# Altium schematic sheet Logic.SchDoc
size C; SheetNumber: 1; SheetTotal: 1
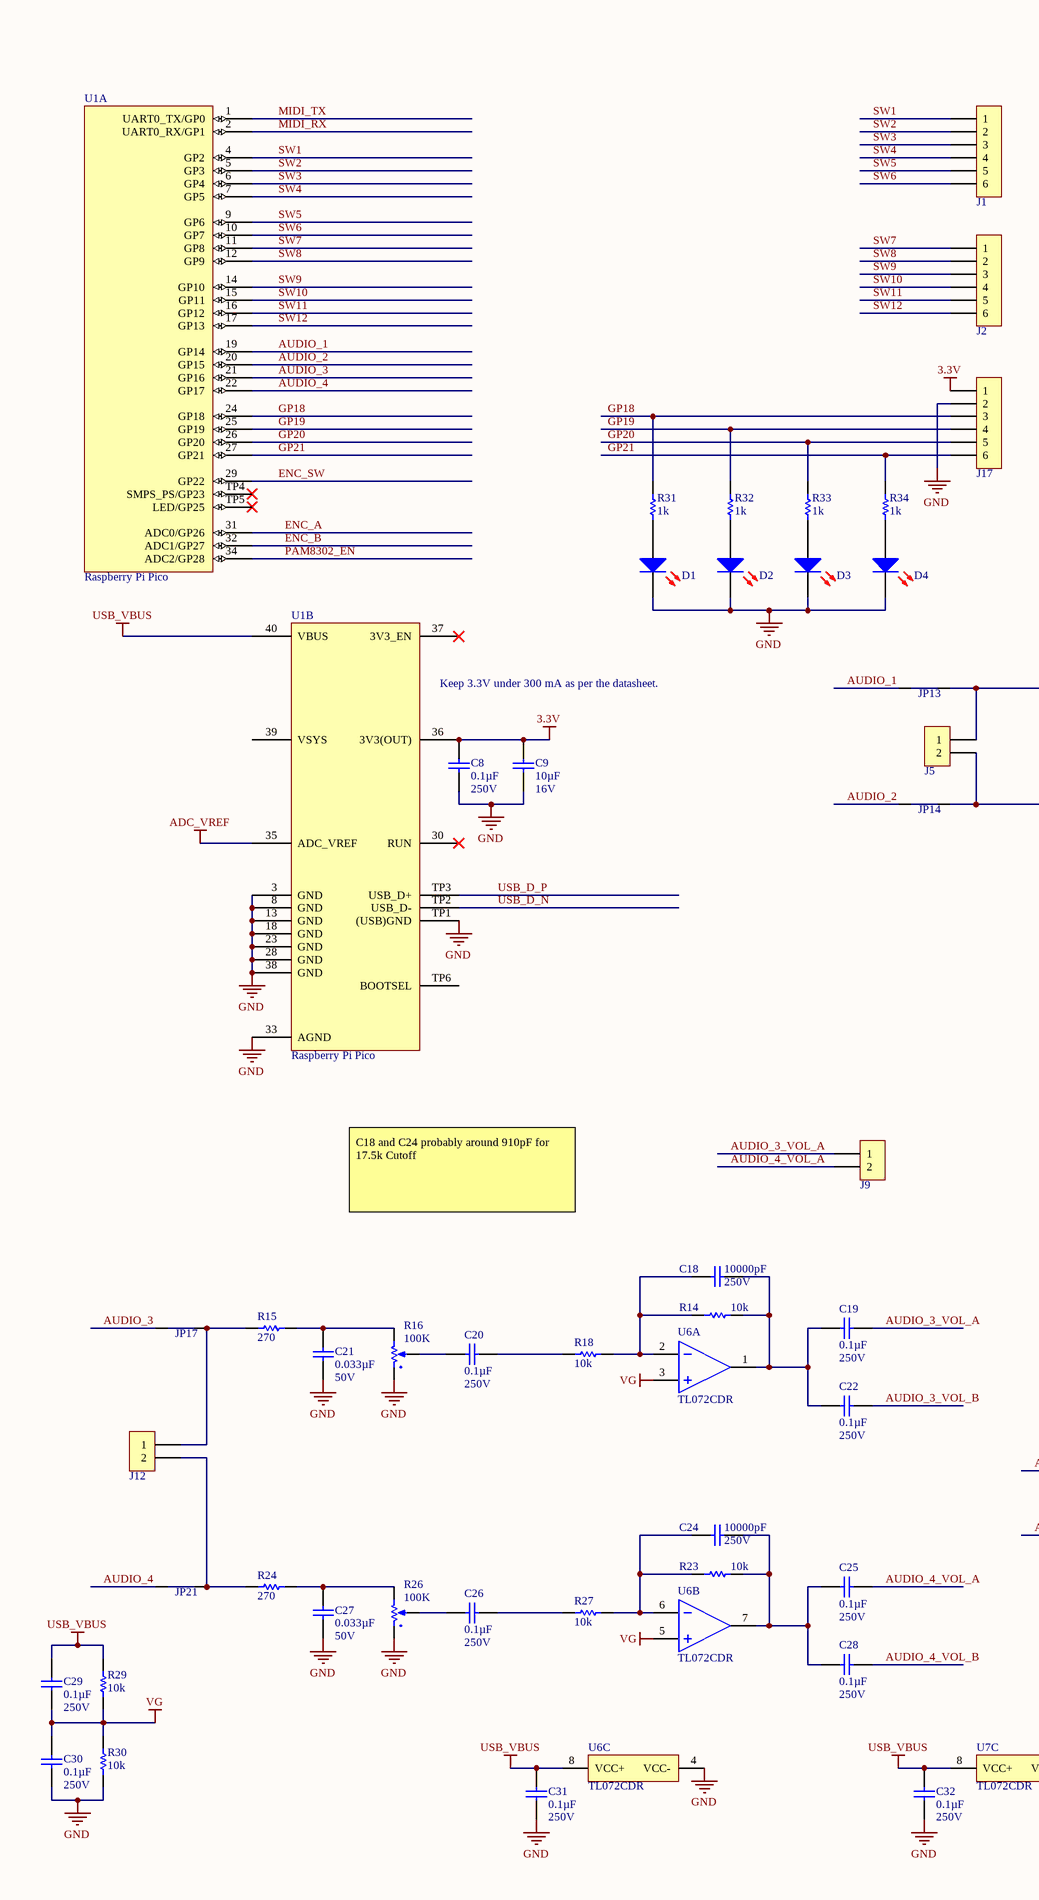
[diagram p0: Logic.SchDoc, left]
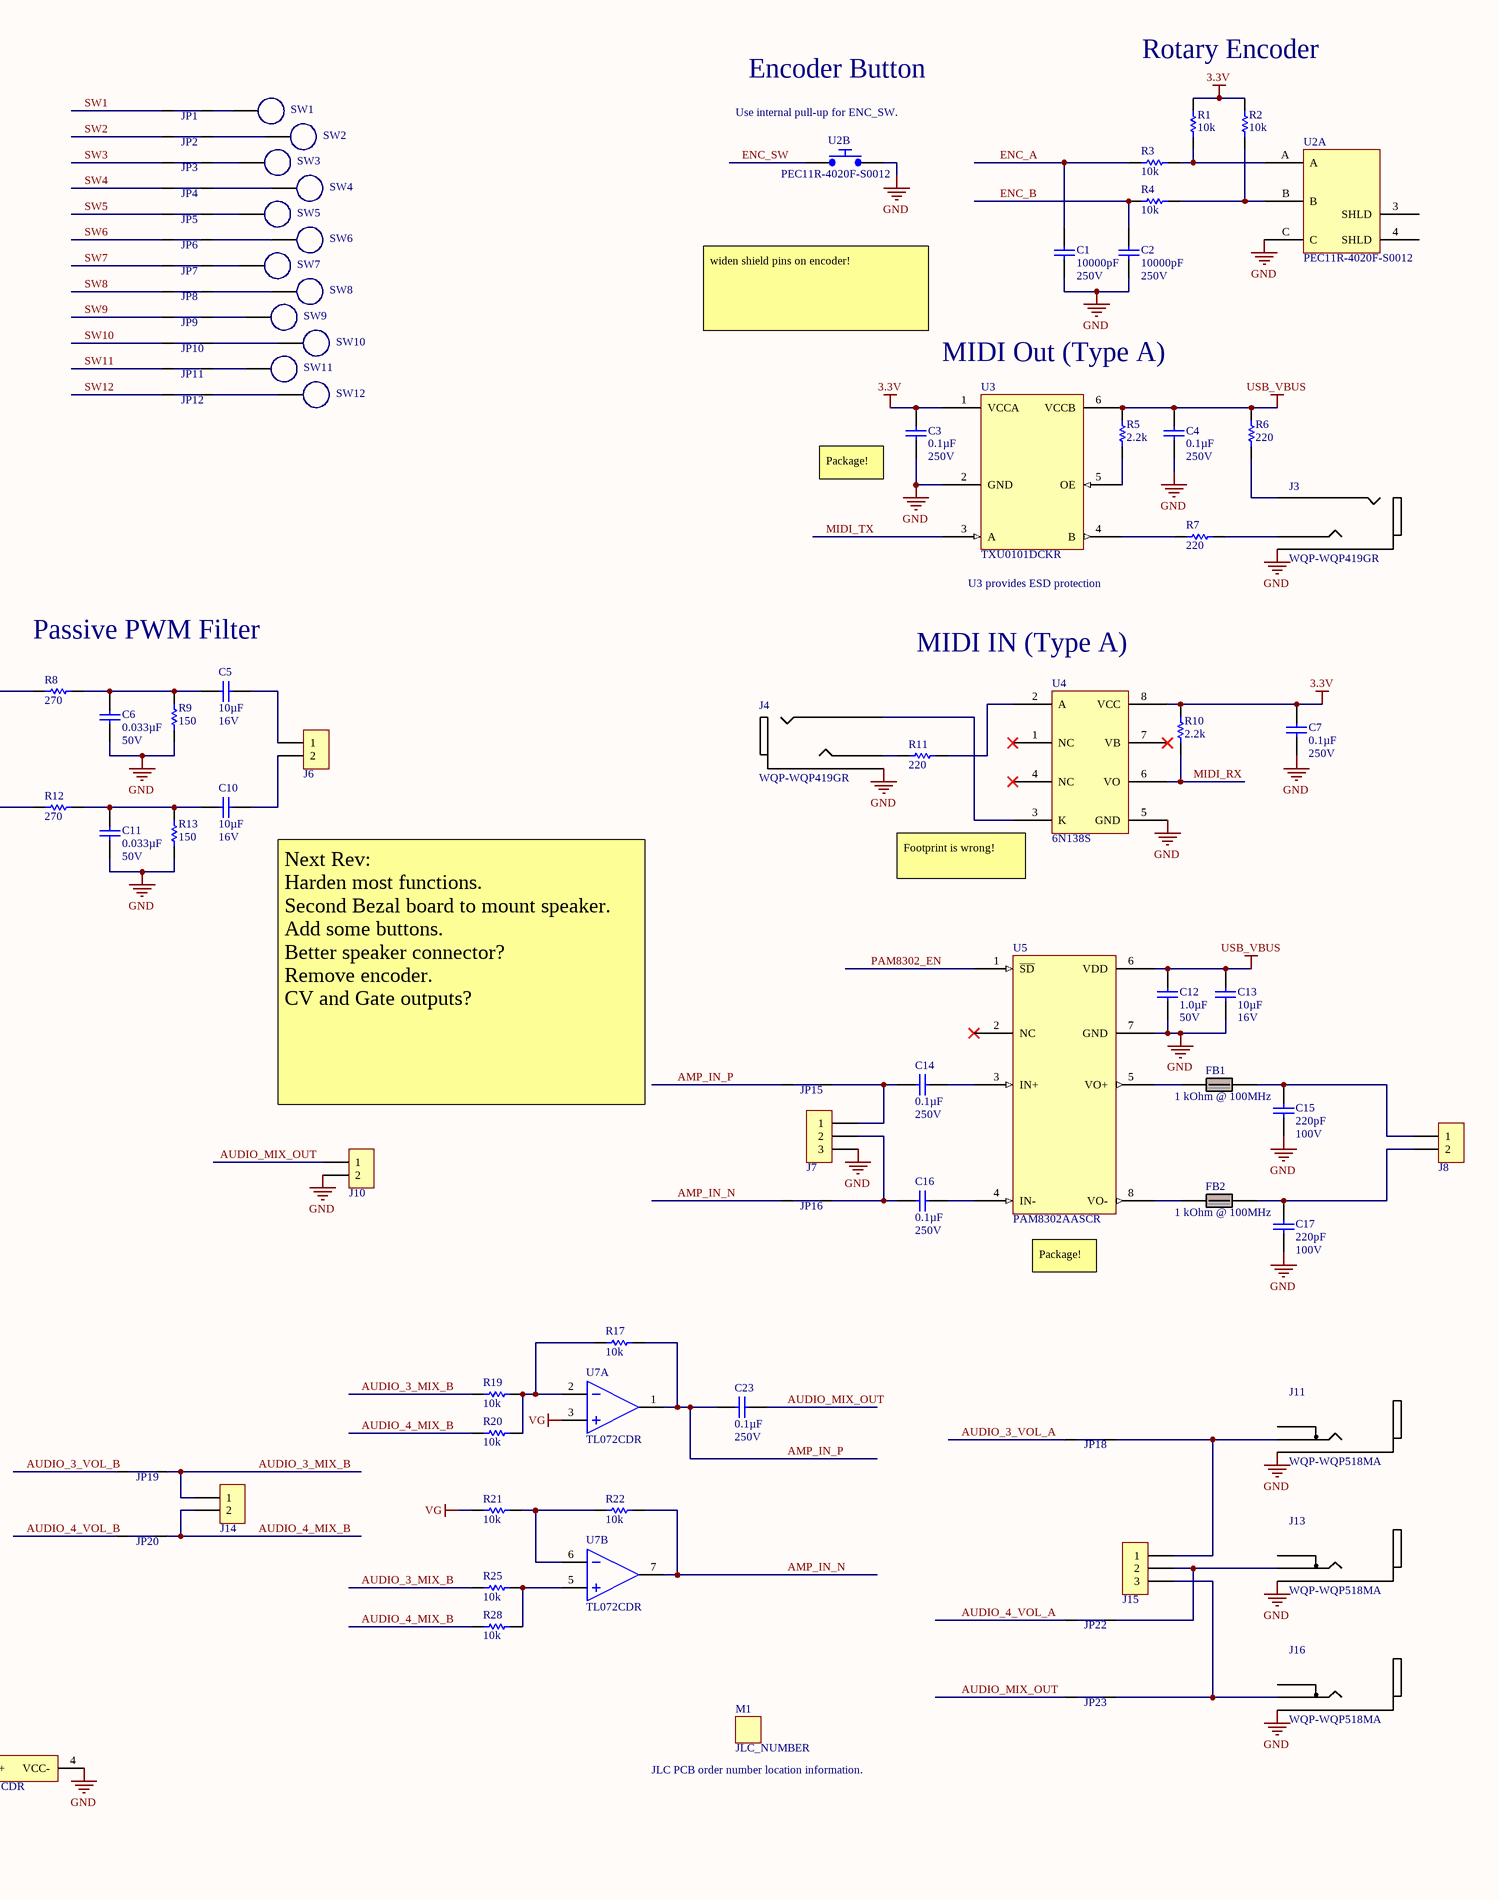
[diagram p1: Logic.SchDoc, right]

## Parts
C1  10000pF  Voltage: 250V  [Chip0805]
C2  10000pF  Voltage: 250V  [Chip0805]
C3  0.1µF  Voltage: 250V  [Chip0805]
C4  0.1µF  Voltage: 250V  [Chip0805]
C5  10µF  Voltage: 16V  [Chip0805]
C6  0.033µF  Voltage: 50V  [Chip0805]
C7  0.1µF  Voltage: 250V  [Chip0805]
C8  0.1µF  Voltage: 250V  [Chip0805]
C9  10µF  Voltage: 16V  [Chip0805]
C10  10µF  Voltage: 16V  [Chip0805]
C11  0.033µF  Voltage: 50V  [Chip0805]
C12  1.0µF  Voltage: 50V  [Chip0805]
C13  10µF  Voltage: 16V  [Chip0805]
C14  0.1µF  Voltage: 250V  [Chip0805]
C15  220pF  Voltage: 100V  [Chip0805]
C16  0.1µF  Voltage: 250V  [Chip0805]
C17  220pF  Voltage: 100V  [Chip0805]
C18  10000pF  Voltage: 250V  [Chip0805]
C19  0.1µF  Voltage: 250V  [Chip0805]
C20  0.1µF  Voltage: 250V  [Chip0805]
C21  0.033µF  Voltage: 50V  [Chip0805]
C22  0.1µF  Voltage: 250V  [Chip0805]
C23  0.1µF  Voltage: 250V  [Chip0805]
C24  10000pF  Voltage: 250V  [Chip0805]
C25  0.1µF  Voltage: 250V  [Chip0805]
C26  0.1µF  Voltage: 250V  [Chip0805]
C27  0.033µF  Voltage: 50V  [Chip0805]
C28  0.1µF  Voltage: 250V  [Chip0805]
C29  0.1µF  Voltage: 250V  [Chip0805]
C30  0.1µF  Voltage: 250V  [Chip0805]
C31  0.1µF  Voltage: 250V  [Chip0805]
C32  0.1µF  Voltage: 250V  [Chip0805]
D1  RED  [LED0603]  (value not drawn)
D2  RED  [LED0603]  (value not drawn)
D3  RED  [LED0603]  (value not drawn)
D4  RED  [LED0603]  (value not drawn)
FB1  Impedance @ Frequency: 1 kOhm @ 100MHz  [Chip0805]  (hidden comment: FERRITE)
FB2  Impedance @ Frequency: 1 kOhm @ 100MHz  [Chip0805]  (hidden comment: FERRITE)
J1  HEADER_1x6_NO_BOM  [HEADER_1x6_100mil_NP]  (value not drawn)  (no BOM)
J2  HEADER_1x6_NO_BOM  [HEADER_1x6_100mil_NP]  (value not drawn)  (no BOM)
J3  WQP-WQP419GR  [PJ366ST]
J4  WQP-WQP419GR  [PJ366ST]
J5  HEADER_1x2_NO_BOM  [HEADER_1x2_100mil_NP]  (value not drawn)  (no BOM)
J6  HEADER_1x2_NO_BOM  [HEADER_1x2_100mil_NP]  (value not drawn)  (no BOM)
J7  HEADER_1x3_NO_BOM  [HEADER_1x3_100mil_NP]  (value not drawn)  (no BOM)
J8  HEADER_1x2_NO_BOM  [HEADER_1x2_100mil_NP]  (value not drawn)  (no BOM)
J9  HEADER_1x2_NO_BOM  [HEADER_1x2_100mil_NP]  (value not drawn)  (no BOM)
J10  HEADER_1x2_NO_BOM  [HEADER_1x2_100mil_NP]  (value not drawn)  (no BOM)
J11  WQP-WQP518MA  [PJ301M-12]
J12  HEADER_1x2_NO_BOM  [HEADER_1x2_100mil_NP]  (value not drawn)  (no BOM)
J13  WQP-WQP518MA  [PJ301M-12]
J14  HEADER_1x2_NO_BOM  [HEADER_1x2_100mil_NP]  (value not drawn)  (no BOM)
J15  HEADER_1x3_NO_BOM  [HEADER_1x3_100mil_NP]  (value not drawn)  (no BOM)
J16  WQP-WQP518MA  [PJ301M-12]
J17  HEADER_1x6_NO_BOM  [HEADER_1x6_100mil_NP]  (value not drawn)  (no BOM)
JP1  JUMMPER_NC_0805  [JUMMPER_NC_0805]  (value not drawn)  (net tie, no BOM)
JP2  JUMMPER_NC_0805  [JUMMPER_NC_0805]  (value not drawn)  (net tie, no BOM)
JP3  JUMMPER_NC_0805  [JUMMPER_NC_0805]  (value not drawn)  (net tie, no BOM)
JP4  JUMMPER_NC_0805  [JUMMPER_NC_0805]  (value not drawn)  (net tie, no BOM)
JP5  JUMMPER_NC_0805  [JUMMPER_NC_0805]  (value not drawn)  (net tie, no BOM)
JP6  JUMMPER_NC_0805  [JUMMPER_NC_0805]  (value not drawn)  (net tie, no BOM)
JP7  JUMMPER_NC_0805  [JUMMPER_NC_0805]  (value not drawn)  (net tie, no BOM)
JP8  JUMMPER_NC_0805  [JUMMPER_NC_0805]  (value not drawn)  (net tie, no BOM)
JP9  JUMMPER_NC_0805  [JUMMPER_NC_0805]  (value not drawn)  (net tie, no BOM)
JP10  JUMMPER_NC_0805  [JUMMPER_NC_0805]  (value not drawn)  (net tie, no BOM)
JP11  JUMMPER_NC_0805  [JUMMPER_NC_0805]  (value not drawn)  (net tie, no BOM)
JP12  JUMMPER_NC_0805  [JUMMPER_NC_0805]  (value not drawn)  (net tie, no BOM)
JP13  JUMMPER_NC_0805  [JUMMPER_NC_0805]  (value not drawn)  (net tie, no BOM)
JP14  JUMMPER_NC_0805  [JUMMPER_NC_0805]  (value not drawn)  (net tie, no BOM)
JP15  JUMMPER_NC_0805  [JUMMPER_NC_0805]  (value not drawn)  (net tie, no BOM)
JP16  JUMMPER_NC_0805  [JUMMPER_NC_0805]  (value not drawn)  (net tie, no BOM)
JP17  JUMMPER_NC_0805  [JUMMPER_NC_0805]  (value not drawn)  (net tie, no BOM)
JP18  JUMMPER_NC_0805  [JUMMPER_NC_0805]  (value not drawn)  (net tie, no BOM)
JP19  JUMMPER_NC_0805  [JUMMPER_NC_0805]  (value not drawn)  (net tie, no BOM)
JP20  JUMMPER_NC_0805  [JUMMPER_NC_0805]  (value not drawn)  (net tie, no BOM)
JP21  JUMMPER_NC_0805  [JUMMPER_NC_0805]  (value not drawn)  (net tie, no BOM)
JP22  JUMMPER_NC_0805  [JUMMPER_NC_0805]  (value not drawn)  (net tie, no BOM)
JP23  JUMMPER_NC_0805  [JUMMPER_NC_0805]  (value not drawn)  (net tie, no BOM)
M1  JLC_NUMBER  [JLC_NUMBER]  (no BOM)
R1  10k  [Chip0805]
R2  10k  [Chip0805]
R3  10k  [Chip0805]
R4  10k  [Chip0805]
R5  2.2k  [Chip0805]
R6  220  [Chip0805]
R7  220  [Chip0805]
R8  270  [Chip0805]
R9  150  [Chip0805]
R10  2.2k  [Chip0805]
R11  220  [Chip0805]
R12  270  [Chip0805]
R13  150  [Chip0805]
R14  10k  [Chip0805]
R15  270  [Chip0805]
R16  100K  [Alpha_RD901F-40-15R]
R17  10k  [Chip0805]
R18  10k  [Chip0805]
R19  10k  [Chip0805]
R20  10k  [Chip0805]
R21  10k  [Chip0805]
R22  10k  [Chip0805]
R23  10k  [Chip0805]
R24  270  [Chip0805]
R25  10k  [Chip0805]
R26  100K  [Alpha_RD901F-40-15R]
R27  10k  [Chip0805]
R28  10k  [Chip0805]
R29  10k  [Chip0805]
R30  10k  [Chip0805]
R31  1k  [Chip0805]
R32  1k  [Chip0805]
R33  1k  [Chip0805]
R34  1k  [Chip0805]
SW1  TOUCH_PAD_NO_BOM  [TENTED_PAD_5mil]  (value not drawn)  (no BOM)
SW2  TOUCH_PAD_NO_BOM  [TENTED_PAD_5mil]  (value not drawn)  (no BOM)
SW3  TOUCH_PAD_NO_BOM  [TENTED_PAD_5mil]  (value not drawn)  (no BOM)
SW4  TOUCH_PAD_NO_BOM  [TENTED_PAD_5mil]  (value not drawn)  (no BOM)
SW5  TOUCH_PAD_NO_BOM  [TENTED_PAD_5mil]  (value not drawn)  (no BOM)
SW6  TOUCH_PAD_NO_BOM  [TENTED_PAD_5mil]  (value not drawn)  (no BOM)
SW7  TOUCH_PAD_NO_BOM  [TENTED_PAD_5mil]  (value not drawn)  (no BOM)
SW8  TOUCH_PAD_NO_BOM  [TENTED_PAD_5mil]  (value not drawn)  (no BOM)
SW9  TOUCH_PAD_NO_BOM  [TENTED_PAD_5mil]  (value not drawn)  (no BOM)
SW10  TOUCH_PAD_NO_BOM  [TENTED_PAD_5mil]  (value not drawn)  (no BOM)
SW11  TOUCH_PAD_NO_BOM  [TENTED_PAD_5mil]  (value not drawn)  (no BOM)
SW12  TOUCH_PAD_NO_BOM  [TENTED_PAD_5mil]  (value not drawn)  (no BOM)
U1  Raspberry Pi Pico  [RASPBERRY_PI_PICO]  (parts A,B of 2)
U2  PEC11R-4020F-S0012  [BOURNS_PEC11R-4020F-S]  (parts A,B of 2)
U3  TXU0101DCKR  [6-TSSOP]
U4  6N138S  [6N13XS]
U5  PAM8302AASCR  [8-MSOP]
U6  TL072CDR  [8-SOIC]  (parts A,B,C of 3)
U7  TL072CDR  [8-SOIC]  (parts A,B,C of 3)

## Nets
3.3V: C3.2 C7.2 C8.2 C9.2 J17.1 R1.2 R2.2 R10.2 U1.36(3V3(OUT)) U3.1(VCCA) U4.8(VCC)
ADC_VREF: U1.35(ADC_VREF)
GND: C1.1 C2.1 C3.1 C4.1 C6.1 C7.1 C8.1 C9.1 C11.1 C12.1 C13.1 C15.1 C17.1 C21.1 C27.1 C30.2 C31.2 C32.2 D1.2(C) D2.2(C) D3.2(C) D4.2(C) J3.1 J4.1 J7.3 J10.2 J11.1 J13.1 J16.1 J17.2 R9.1 R13.1 R16.1(BOT) R26.1(BOT) R30.2 U1.3(GND) U1.8(GND) U1.13(GND) U1.18(GND) U1.23(GND) U1.28(GND) U1.33(AGND) U1.38(GND) U1.TP1((USB)GND) U2.1 U2.C U3.2(GND) U4.5(GND) U5.7(GND) U6.4(VCC-) U7.4(VCC-)
USB_VBUS: C4.2 C12.2 C13.2 C29.1 C31.1 C32.1 R5.2 R6.2 R29.1 U1.40(VBUS) U3.6(VCCB) U5.6(VDD) U6.8(VCC+) U7.8(VCC+)
VG: C29.2 C30.1 R21.2 R29.2 R30.1 U6.3(IN1+) U6.5(IN2+) U7.3(IN1+)
AMP_IN_N: JP16.1 R22.1 U7.7(OUT2)
AMP_IN_P: C23.2 JP15.1 R17.1 U7.1(OUT1)
AUDIO_1: JP13.1 U1.19(GP14)
AUDIO_2: JP14.1 U1.20(GP15)
AUDIO_3: JP17.1 U1.21(GP16)
AUDIO_3_MIX_B: J14.1 JP19.2 R19.2 R25.2
AUDIO_3_VOL_A: C19.1 J9.1 JP18.1
AUDIO_3_VOL_B: C22.1 JP19.1
AUDIO_4: JP21.1 U1.22(GP17)
AUDIO_4_MIX_B: J14.2 JP20.2 R20.2 R28.2
AUDIO_4_VOL_A: C25.1 J9.2 JP22.1
AUDIO_4_VOL_B: C28.1 JP20.1
AUDIO_MIX_OUT: C23.1 J10.1 JP23.1
ENC_A: C1.2 R3.2 U1.31(ADC0/GP26)
ENC_B: C2.2 R4.2 U1.32(ADC1/GP27)
ENC_SW: U1.29(GP22) U2.2
GP18: J17.3 R31.2 U1.24(GP18)
GP19: J17.4 R32.2 U1.25(GP19)
GP20: J17.5 R33.2 U1.26(GP20)
GP21: J17.6 R34.2 U1.27(GP21)
MIDI_RX: R10.1 U1.2(UART0_RX/GP1) U4.6(VO)
MIDI_TX: U1.1(UART0_TX/GP0) U3.3(A)
PAM8302_EN: U1.34(ADC2/GP28) U5.1(~{SD})
SW1: J1.1 JP1.1 U1.4(GP2)
SW2: J1.2 JP2.1 U1.5(GP3)
SW3: J1.3 JP3.1 U1.6(GP4)
SW4: J1.4 JP4.1 U1.7(GP5)
SW5: J1.5 JP5.1 U1.9(GP6)
SW6: J1.6 JP6.1 U1.10(GP7)
SW7: J2.1 JP7.1 U1.11(GP8)
SW8: J2.2 JP8.1 U1.12(GP9)
SW9: J2.3 JP9.1 U1.14(GP10)
SW10: J2.4 JP10.1 U1.15(GP11)
SW11: J2.5 JP11.1 U1.16(GP12)
SW12: J2.6 JP12.1 U1.17(GP13)
USB_D_N: U1.TP2(USB_D-)
USB_D_P: U1.TP3(USB_D+)
NetC5_1: C5.1 C6.2 R8.2 R9.2
NetC5_2: C5.2 J6.1
NetC10_1: C10.1 C11.2 R12.2 R13.2
NetC10_2: C10.2 J6.2
NetC14_1: C14.1 U5.3(IN+)
NetC14_2: C14.2 J7.1 JP15.2
NetC15_2: C15.2 FB1.2 J8.1
NetC16_1: C16.1 U5.4(IN-)
NetC16_2: C16.2 J7.2 JP16.2
NetC17_2: C17.2 FB2.2 J8.2
NetC18_1: C18.1 C19.2 C22.2 R14.1 U6.1(OUT1)
NetC18_2: C18.2 R14.2 R18.1 U6.2(IN1-)
NetC20_1: C20.1 R18.2
NetC20_2: C20.2 R16.2(TAP)
NetC21_2: C21.2 R15.2 R16.3(TOP)
NetC24_1: C24.1 C25.2 C28.2 R23.1 U6.7(OUT2)
NetC24_2: C24.2 R23.2 R27.1 U6.6(IN2-)
NetC26_1: C26.1 R27.2
NetC26_2: C26.2 R26.2(TAP)
NetC27_2: C27.2 R24.2 R26.3(TOP)
NetD1_1: D1.1(A) R31.1
NetD2_1: D2.1(A) R32.1
NetD3_1: D3.1(A) R33.1
NetD4_1: D4.1(A) R34.1
NetFB1_1: FB1.1 U5.5(VO+)
NetFB2_1: FB2.1 U5.8(VO-)
NetJ3_2: J3.2 R6.1
NetJ3_3: J3.3 R7.2
NetJ4_2: J4.2 U4.3(K)
NetJ4_3: J4.3 R11.1
NetJ5_1: J5.1 JP13.2 R8.1
NetJ5_2: J5.2 JP14.2 R12.1
NetJ11_3: J11.3 J15.1 JP18.2
NetJ12_1: J12.1 JP17.2 R15.1
NetJ12_2: J12.2 JP21.2 R24.1
NetJ13_3: J13.3 J15.2 JP22.2
NetJ15_3: J15.3 J16.3 JP23.2
NetJP1_2: JP1.2 SW1.1
NetJP2_2: JP2.2 SW2.1
NetJP3_2: JP3.2 SW3.1
NetJP4_2: JP4.2 SW4.1
NetJP5_2: JP5.2 SW5.1
NetJP6_2: JP6.2 SW6.1
NetJP7_2: JP7.2 SW7.1
NetJP8_2: JP8.2 SW8.1
NetJP9_2: JP9.2 SW9.1
NetJP10_2: JP10.2 SW10.1
NetJP11_2: JP11.2 SW11.1
NetJP12_2: JP12.2 SW12.1
NetR1_1: R1.1 R3.1 U2.A
NetR2_1: R2.1 R4.1 U2.B
NetR5_1: R5.1 U3.5(OE)
NetR7_1: R7.1 U3.4(B)
NetR11_2: R11.2 U4.2(A)
NetR17_2: R17.2 R19.1 R20.1 U7.2(IN1-)
NetR21_1: R21.1 R22.2 U7.6(IN2-)
NetR25_1: R25.1 R28.1 U7.5(IN2+)

Not connected (* = marked no-connect by the designer): J11 2; J13 2; J16 2; U1 30(RUN)* 37(3V3_EN)* 39(VSYS) TP4(SMPS_PS/GP23)* TP5(LED/GP25)* TP6(BOOTSEL); U2 3(SHLD) 4(SHLD); U4 1(NC)* 4(NC)* 7(VB)*; U5 2(NC)*

## Notes on the sheet
- Rotary Encoder
- (near U2) Use internal pull-up for ENC_SW.
- Encoder Button
- widen shield pins on encoder!
- MIDI Out (Type A)
- (near C3) Package!
- Passive PWM Filter
- MIDI IN (Type A)
- U3 provides ESD protection
- (near U1) Keep 3.3V under 300 mA as per the datasheet.
- (near U4) Footprint is wrong!
- Next Rev:
  Harden most functions.
  Second Bezal board to mount speaker.
  Add some buttons.
  Better speaker connector?
  Remove encoder.
  CV and Gate outputs?
- C18 and C24 probably around 910pF for 17.5k Cutoff
- (near U5) Package!
- (near M1) JLC PCB order number location information.
- Title:
- This work is licensed under a Creative Commons Attribution 4.0 International License. Derivative works should remove all Sophistry branding and ‘é’ watermark.
- Date:
- Engineer:
- Revision:
- Codename:
- Time:
- Variant:
- Sheet
- of

## Library data of the parts
C1 C2 C18 C24 = C2012X7R2E103M125AE: CAP CER 10000PF 250V X7R 0805; Manufacturer: TDK Corporation; Tolerance: ±20%; PartNumber: C2012X7R2E103M125AE; HelpURL: http://product.tdk.com/capacitor/mlcc/en/documents/mlcc_commercial_soft_en.pdf; Supplier 1: Digi-Key; Supplier Part Number 1: 445-6805-1-ND; Supplier 2: Mouser; Manufacturer Part Number: C2012X7R2E103M125AE; Series: C; Capacitance: 10000pF; Temperature Coefficient: X7R; Mounting Type: Surface Mount, MLCC; Operating Temperature: -55°C ~ 125°C; Applications: Boardflex Sensitive; Ratings: -; Package / Case: 0805 (2012 Metric); Size / Dimension: 0.079" L x 0.049" W (2.00mm x 1.25mm); Height - Seated (Max): -; Thickness (Max): 0.057" (1.45mm); Lead Spacing: -; Features: Soft Termination; Lead Style: -
C3 C4 C7 C8 C14 C16 C19 C20 C22 C23 C25 C26 C28-C32 = C2012X7T2E104K125AA: CAP CER 0.1UF 250V 10% X7T 0805; Manufacturer: TDK Corporation; PartNumber: C2012X7T2E104K125AA; HelpURL: http://product.tdk.com/capacitor/mlcc/en/documents/mlcc_commercial_midvoltage_en.pdf; Supplier 1: Digi-Key; Supplier Part Number 1: 445-7749-1-ND; Supplier 2: Mouser; Manufacturer Part Number: C2012X7T2E104K125AA; Series: C; Capacitance: 0.1µF; Tolerance: ±10%; Temperature Coefficient: X7T; Mounting Type: Surface Mount, MLCC; Operating Temperature: -55°C ~ 125°C; Applications: General Purpose; Ratings: -; Package / Case: 0805 (2012 Metric); Size / Dimension: 0.079" L x 0.049" W (2.00mm x 1.25mm); Height - Seated (Max): -; Thickness (Max): 0.057" (1.45mm); Lead Spacing: -; Features: -; Lead Style: -
C5 C9 C10 C13 = C2012X5R1C106K125AC: CAP CER 10UF 16V 10% X5R 0805; Manufacturer: TDK Corporation; PartNumber: C2012X5R1C106K125AC; HelpURL: http://product.tdk.com/capacitor/mlcc/en/documents/mlcc_commercial_general_en.pdf; Supplier 1: Digi-Key; Supplier Part Number 1: 445-7646-1-ND; Supplier 2: Mouser; Manufacturer Part Number: C2012X5R1C106K125AC; Series: C; Capacitance: 10µF; Tolerance: ±10%; Temperature Coefficient: X5R; Mounting Type: Surface Mount, MLCC; Operating Temperature: -55°C ~ 85°C; Applications: General Purpose; Ratings: -; Package / Case: 0805 (2012 Metric); Size / Dimension: 0.079" L x 0.049" W (2.00mm x 1.25mm); Height - Seated (Max): -; Thickness (Max): 0.057" (1.45mm); Lead Spacing: -; Features: -; Lead Style: -
C6 C11 C21 C27 = C2012C0G1H333J125AA: CAP CER 0.033UF 50V 5% NP0 0805; Manufacturer: TDK Corporation; Temperature Coefficient: C0G, NP0; PartNumber: C2012C0G1H333J125AA; HelpURL: http://product.tdk.com/capacitor/mlcc/en/documents/mlcc_commercial_general_en.pdf; Supplier 1: Digi-Key; Supplier Part Number 1: 445-7523-1-ND; Supplier 2: Mouser; Manufacturer Part Number: C2012C0G1H333J125AA; Series: C; Capacitance: 0.033µF; Tolerance: ±5%; Mounting Type: Surface Mount, MLCC; Operating Temperature: -55°C ~ 125°C; Applications: General Purpose; Ratings: -; Package / Case: 0805 (2012 Metric); Size / Dimension: 0.079" L x 0.049" W (2.00mm x 1.25mm); Height - Seated (Max): -; Thickness (Max): 0.057" (1.45mm); Lead Spacing: -; Features: -; Lead Style: -
C12 = C2012X7R1H105M125AB: CAP CER 1UF 50V 20% X7R 0805; Manufacturer: TDK Corporation; PartNumber: C2012X7R1H105M125AB; HelpURL: http://product.tdk.com/capacitor/mlcc/en/documents/mlcc_commercial_general_en.pdf; Supplier 1: Digi-Key; Supplier Part Number 1: 445-7548-1-ND; Supplier 2: Mouser; Manufacturer Part Number: C2012X7R1H105M125AB; Series: C; Capacitance: 1.0µF; Tolerance: ±20%; Temperature Coefficient: X7R; Mounting Type: Surface Mount, MLCC; Operating Temperature: -55°C ~ 125°C; Applications: General Purpose; Ratings: -; Package / Case: 0805 (2012 Metric); Size / Dimension: 0.079" L x 0.049" W (2.00mm x 1.25mm); Height - Seated (Max): -; Thickness (Max): 0.057" (1.45mm); Lead Spacing: -; Features: -; Lead Style: -
C15 C17 = C2012C0G2A221J: CAP CER 220PF 100V 5% NP0 0805; Manufacturer: TDK Corporation; Temperature Coefficient: C0G, NP0; PartNumber: C2012C0G2A221J; HelpURL: http://media.digikey.com/pdf/Data%20Sheets/TDK%20PDFs/C_Series_MidVoltage_B11.pdf; Supplier 1: Digi-Key; Supplier Part Number 1: 445-4133-1-ND; Supplier 2: Mouser; Manufacturer Part Number: C2012C0G2A221J; Series: C; Capacitance: 220pF; Tolerance: ±5%; Mounting Type: Surface Mount, MLCC; Operating Temperature: -55°C ~ 125°C; Applications: General Purpose; Ratings: -; Package / Case: 0805 (2012 Metric); Size / Dimension: 0.079" L x 0.049" W (2.00mm x 1.25mm); Height - Seated (Max): -; Thickness (Max): 0.030" (0.75mm); Lead Spacing: -; Features: -; Lead Style: -
D1-D4 = LTST-C191KRKT: LED SUPER RED CLR THIN 0603 SMD; Manufacturer: Lite-On Inc; PartNumber: LTST-C191KRKT; Datasheets: http://optoelectronics.liteon.com/upload/download/DS22-2000-223/S_110_LTST-C191KRKT.pdf; Supplier 1: Digi-Key; Supplier Part Number 1: 160-1447-1-ND; Supplier 2: Mouser; Supplier Part Number 2: 859-LTST-C191KRKT; Manufacturer Part Number: LTST-C191KRKT; Color: Red
FB1 FB2 = 74279205: FERRITE BEAD 1000 OHM .20A 0805; Manufacturer: Wurth Electronics Inc; Current Rating: 200mA; DC Resistance (DCR): 450 mOhm Max; Filter Type: Differential Mode - Single; PartNumber: 74279205; HelpURL: http://katalog.we-online.de/pbs/datasheet/74279205.pdf; Supplier 1: Digi-Key; Supplier Part Number 1: 732-1606-1-ND; Manufacturer Part Number: 74279205; Series: WE-CBF; Package / Case: 0805 (2012 Metric); Mounting Type: Surface Mount; Height (Max): 0.043" (1.10mm); Size / Dimension: 0.079" L x 0.047" W (2.00mm x 1.20mm)
J3 J4 = WQP-WQP419GR: CONN 3.5mm VIRTICAL STEREO; Manufacturer: QingPu; Connector Type: Phone Jack; Gender: Female; PartNumber: WQP-WQP419GR; HelpURL: http://www.qingpu-electronics.com/en/products/WQP-PJ366ST-364.html; Supplier 1: QingPu; Supplier Part Number 1: WQP-WQP419GR; Manufacturer Part Number: WQP-WQP419GR; Signal Lines: Stereo
J11 J13 J16 = WQP-WQP518MA: CONN 3.5mm VIRTICAL MONO w/ NORMAL; Manufacturer: QingPu; Connector Type: Phone Jack; Gender: Female; PartNumber: WQP-WQP518MA; HelpURL: http://www.qingpu-electronics.com/en/products/WQP-PJ398SM-362.html; Supplier 1: QingPu; Supplier Part Number 1: WQP-WQP518MA; Manufacturer Part Number: WQP-WQP518MA; Signal Lines: Mono
M1 = JLC_NUMBER: JLC Order Number Location; PartNumber: JLC_NUMBER; Manufacturer Part Number: JLC_NUMBER
R1-R4 R14 R17-R23 R25 R27-R30 = CRCW080510K0FKEA: RES 10.0K OHM 1/8W 1% 0805 SMD; Manufacturer: Vishay Dale; Power (Watts): 0.125W, 1/8W; Temperature Coefficient: ±100ppm/°C; PartNumber: CRCW080510K0FKEA; HelpURL: http://www.vishay.com/doc?20035; Supplier 1: Digi-Key; Supplier Part Number 1: 541-10.0KCCT-ND; Supplier 2: Mouser; Manufacturer Part Number: CRCW080510K0FKEA; Series: CRCW; Resistance: 10k; Tolerance: ±1%; Composition: Thick Film; Features: Automotive AEC-Q200 Qualified; Package / Case: 0805 (2012 Metric); Supplier Device Package: 0805 (2012 Metric); Size / Dimension: 0.079" L x 0.049" W (2.00mm x 1.25mm); Height: 0.020" (0.50mm); Number of Terminations: 2
R5 R10 = CRCW08052K20FKEA: RES 2.20K OHM 1/8W 1% 0805 SMD; Manufacturer: Vishay Dale; Power (Watts): 0.125W, 1/8W; Temperature Coefficient: ±100ppm/°C; PartNumber: CRCW08052K20FKEA; HelpURL: http://www.vishay.com/doc?20035; Supplier 1: Digi-Key; Supplier Part Number 1: 541-2.20KCCT-ND; Supplier 2: Mouser; Manufacturer Part Number: CRCW08052K20FKEA; Series: CRCW; Resistance: 2.2k; Tolerance: ±1%; Composition: Thick Film; Features: Automotive AEC-Q200 Qualified; Package / Case: 0805 (2012 Metric); Supplier Device Package: 0805 (2012 Metric); Size / Dimension: 0.079" L x 0.049" W (2.00mm x 1.25mm); Height: 0.020" (0.50mm); Number of Terminations: 2
R6 R7 R11 = CRCW0805220RFKEA: RES 220 OHM 1/8W 1% 0805 SMD; Manufacturer: Vishay Dale; Power (Watts): 0.125W, 1/8W; Temperature Coefficient: ±100ppm/°C; PartNumber: CRCW0805220RFKEA; HelpURL: http://www.vishay.com/doc?20035; Supplier 1: Digi-Key; Supplier Part Number 1: 541-220CCT-ND; Supplier 2: Mouser; Manufacturer Part Number: CRCW0805220RFKEA; Series: CRCW; Resistance: 220; Tolerance: ±1%; Composition: Thick Film; Features: Automotive AEC-Q200 Qualified; Package / Case: 0805 (2012 Metric); Supplier Device Package: 0805 (2012 Metric); Size / Dimension: 0.079" L x 0.049" W (2.00mm x 1.25mm); Height: 0.020" (0.50mm); Number of Terminations: 2
R8 R12 R15 R24 = CRCW0805270RFKEA: RES 270 OHM 1/8W 1% 0805 SMD; Manufacturer: Vishay Dale; Power (Watts): 0.125W, 1/8W; Temperature Coefficient: ±100ppm/°C; PartNumber: CRCW0805270RFKEA; HelpURL: http://www.vishay.com/doc?20035; Supplier 1: Digi-Key; Supplier Part Number 1: 541-270CCT-ND; Supplier 2: Mouser; Manufacturer Part Number: CRCW0805270RFKEA; Series: CRCW; Resistance: 270; Tolerance: ±1%; Composition: Thick Film; Features: Automotive AEC-Q200 Qualified; Package / Case: 0805 (2012 Metric); Supplier Device Package: 0805 (2012 Metric); Size / Dimension: 0.079" L x 0.049" W (2.00mm x 1.25mm); Height: 0.020" (0.50mm); Number of Terminations: 2
R9 R13 = CRCW0805150RFKEA: RES 150 OHM 1/8W 1% 0805 SMD; Manufacturer: Vishay Dale; Power (Watts): 0.125W, 1/8W; Temperature Coefficient: ±100ppm/°C; PartNumber: CRCW0805150RFKEA; HelpURL: http://www.vishay.com/doc?20035; Supplier 1: Digi-Key; Supplier Part Number 1: 541-150CCT-ND; Supplier 2: Mouser; Manufacturer Part Number: CRCW0805150RFKEA; Series: CRCW; Resistance: 150; Tolerance: ±1%; Composition: Thick Film; Features: Automotive AEC-Q200 Qualified; Package / Case: 0805 (2012 Metric); Supplier Device Package: 0805 (2012 Metric); Size / Dimension: 0.079" L x 0.049" W (2.00mm x 1.25mm); Height: 0.020" (0.50mm); Number of Terminations: 2
R16 R26 = RD901F-40-15R-B100K: POT 100K OHM 9MM RD 1/20W; Manufacturer: Alpha (Taiwan); Power (Watts): 0.05W, 1/20W; Number of Turns: 1; Adjustment Type: Top Adjustment; Resistive Material: Carbon; Actuator Type: Round Shaft; Actuator Diameter: 0.250" (6.35mm); PartNumber: RD901F-40-15R-B100K; HelpURL: http://www.taiwanalpha.com.tw/english2014/p_e_022.htm; Supplier 1: Small Bear Electronics; Supplier Part Number 1: 1012A; Taper: Linear; Manufacturer Part Number: RD901F-40-15R-B100K; Series: RD901F-40-15R; Resistance: 100K; Termination Style: PCB Pins; Mounting Type: Through Hole
R31-R34 = CRCW08051K00FKEA: RES 1.00K OHM 1/8W 1% 0805 SMD; Manufacturer: Vishay Dale; Power (Watts): 0.125W, 1/8W; Temperature Coefficient: ±100ppm/°C; PartNumber: CRCW08051K00FKEA; HelpURL: http://www.vishay.com/doc?20035; Supplier 1: Digi-Key; Supplier Part Number 1: 541-1.00KCCT-ND; Supplier 2: Mouser; Manufacturer Part Number: CRCW08051K00FKEA; Series: CRCW; Resistance: 1k; Tolerance: ±1%; Composition: Thick Film; Features: Automotive AEC-Q200 Qualified; Package / Case: 0805 (2012 Metric); Supplier Device Package: 0805 (2012 Metric); Size / Dimension: 0.079" L x 0.049" W (2.00mm x 1.25mm); Height: 0.020" (0.50mm); Number of Terminations: 2
U1 = Raspberry Pi Pico: RASPBERRY PI PICO RP2040 BOARD; Manufacturer Part Number: SC0915; PartNumber: Raspberry Pi Pico; Supplier 1: Digi-Key; Supplier Part Number 1: 2648-SC0915CT-ND; Manufacturer: Raspberry Pi
U2 = PEC11R-4020F-S0012: ROTARY ENCODER MECHANICAL 12PPR; Manufacturer: Bourns Inc.; PartNumber: PEC11R-4020F-S0012; Datasheets: https://www.bourns.com/docs/Product-Datasheets/PEC11R.pdf; Supplier 1: Digi-Key; Supplier 2: Mouser; Supplier Part Number 1: PEC11R-4020F-S0012-ND; Supplier Part Number 2: 652-PEC11R-4020F-S12; Manufacturer Part Number: PEC11R-4020F-S0012
U3 = TXU0101DCKR: SINGLE CHANNEL FIXED-DIRECTION L; Manufacturer: Texas Instruments; PartNumber: TXU0101DCKR; Supplier 1: Digi-Key; Supplier 2: Mouser; Supplier Part Number 1: 296-TXU0101DCKRCT-ND; Supplier Part Number 2: 595-TXU0101DCKR; HelpURL: https://www.ti.com/lit/ds/symlink/txu0101.pdf; Manufacturer Part Number: TXU0101DCKR
U4 = 6N138S: OPTOISO 5KV DARL W/BASE 8SMD; Manufacturer: Lite-On Inc.; PartNumber: 6N138S; Supplier 1: Digi-Key; Supplier 2: Mouser; Supplier Part Number 2: 859-6N138S; HelpURL: https://media.digikey.com/pdf/Data%20Sheets/Lite-On%20PDFs/6N138-39%20Series.pdf; Supplier Part Number 1: 160-1797-ND; Manufacturer Part Number: 6N138S
U5 = PAM8302AASCR: IC AMP CLASS D MONO 2.5W 8MSOP; Manufacturer: Diodes Incorporated; PartNumber: PAM8302AASCR; Supplier 1: Digi-Key; Supplier 2: Mouser; Supplier Part Number 2: 621-PAM8302AASCR; HelpURL: https://www.diodes.com/assets/Datasheets/PAM8302A.pdf; Supplier Part Number 1: PAM8302AASCRDICT-ND; Manufacturer Part Number: PAM8302AASCR
U6 U7 = TL072CDR: IC OPAMP JFET 3MHZ 8SOIC; Manufacturer: Texas Instruments; PartNumber: TL072CDR; HelpURL: http://www.ti.com/lit/ds/symlink/tl071a.pdf; Supplier 1: Digi-Key; Supplier Part Number 1: 296-1282-1-ND; Supplier 2: Mouser; Supplier Part Number 2: 595-TL072CDR; Manufacturer Part Number: TL072CDR
J1 J2 J17 = HEADER_1x6_NO_BOM: PartNumber: HEADER_1x6_NO_BOM; Manufacturer Part Number: HEADER_1x6_NO_BOM
J5 J6 J8-J10 J12 J14 = HEADER_1x2_NO_BOM: PartNumber: HEADER_1x2_NO_BOM; Manufacturer Part Number: HEADER_1x2_NO_BOM
J7 J15 = HEADER_1x3_NO_BOM: PartNumber: HEADER_1x3_NO_BOM; Manufacturer Part Number: HEADER_1x3_NO_BOM
JP1-JP23 = JUMMPER_NC_0805: PartNumber: JUMMPER_NC_0805; Manufacturer Part Number: JUMMPER_NC_0805
SW1-SW12 = TOUCH_PAD_NO_BOM: PartNumber: TOUCH_PAD_NO_BOM; Manufacturer Part Number: TOUCH_PAD_NO_BOM